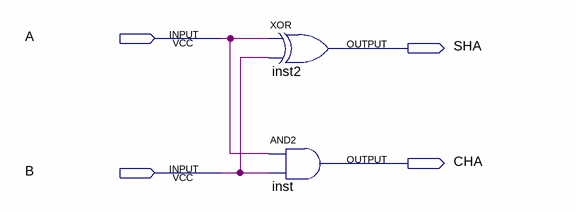
[diagram p0: schematic sheet]
// Quartus schematic HALF.bdf as structural Verilog: 2 symbols, 4 pins
module HALF (
  input  A,
  input  B,
  output SHA,
  output CHA
);

  xor inst2 (SHA, A, B);
  and inst (CHA, A, B);
endmodule
